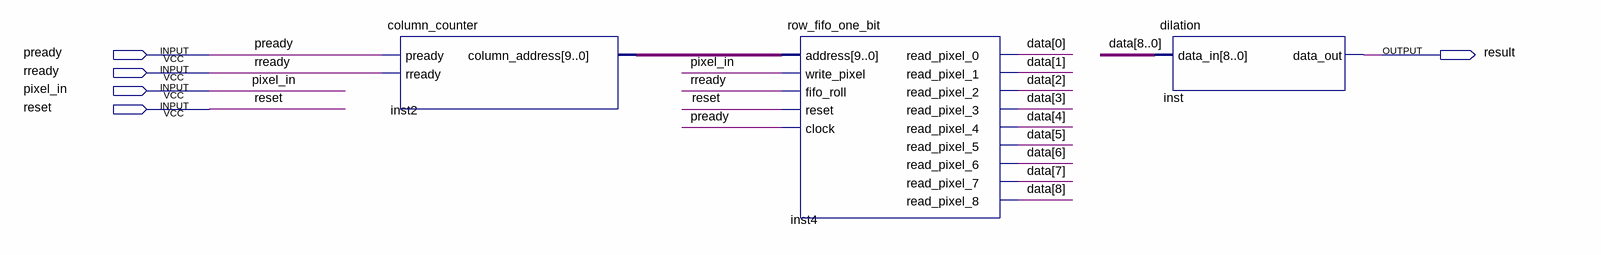
[diagram p0: schematic sheet]
// Quartus schematic dilation_processing.bdf as structural Verilog: 3 symbols, 5 pins
module dilation_processing (
  input  pready,
  input  rready,
  input  pixel_in,
  input  reset,
  output result
);

  wire [8:0] data;
  wire [9:0] inst2_column_address;

  column_counter inst2 (.pready(pready), .rready(rready), .column_address(inst2_column_address));
  row_fifo_one_bit inst4 (
    .address(inst2_column_address), .write_pixel(pixel_in), .fifo_roll(rready), .reset(reset),
    .clock(pready), .read_pixel_0(data[0]), .read_pixel_1(data[1]), .read_pixel_2(data[2]),
    .read_pixel_3(data[3]), .read_pixel_4(data[4]), .read_pixel_5(data[5]), .read_pixel_6(data[6]),
    .read_pixel_7(data[7]), .read_pixel_8(data[8]));
  dilation inst (.data_in(data), .data_out(result));
endmodule
